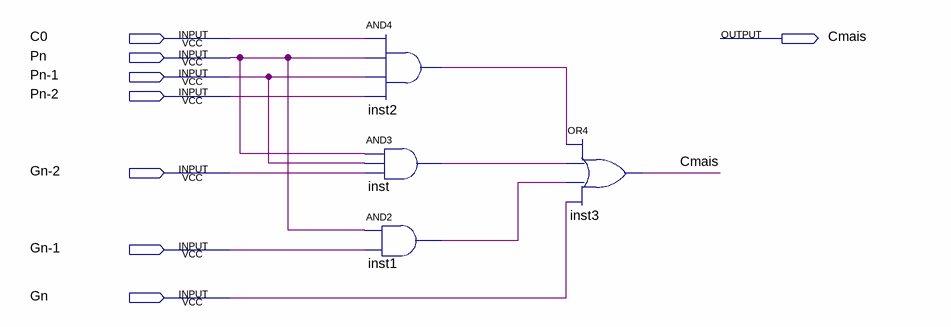
[diagram p0: schematic sheet]
// Quartus schematic cla3.bdf as structural Verilog: 4 symbols, 8 pins
module cla3 (
  input  C0,
  input  Pn,
  input  \Pn-1 ,
  input  \Pn-2 ,
  input  \Gn-2 ,
  input  \Gn-1 ,
  input  Gn,
  output Cmais
);

  wire inst1_out, inst2_out, inst_out;

  and inst2 (inst2_out, C0, Pn, \Pn-1 , \Pn-2 );
  and inst (inst_out, Pn, \Pn-1 , \Gn-2 );
  and inst1 (inst1_out, Pn, \Gn-1 );
  or inst3 (Cmais, inst2_out, inst_out, inst1_out, Gn);
endmodule
